# EAGLE design Cargador_RasPi3HAT_CamSlot_v2.1 (EAGLE 9.3.2)
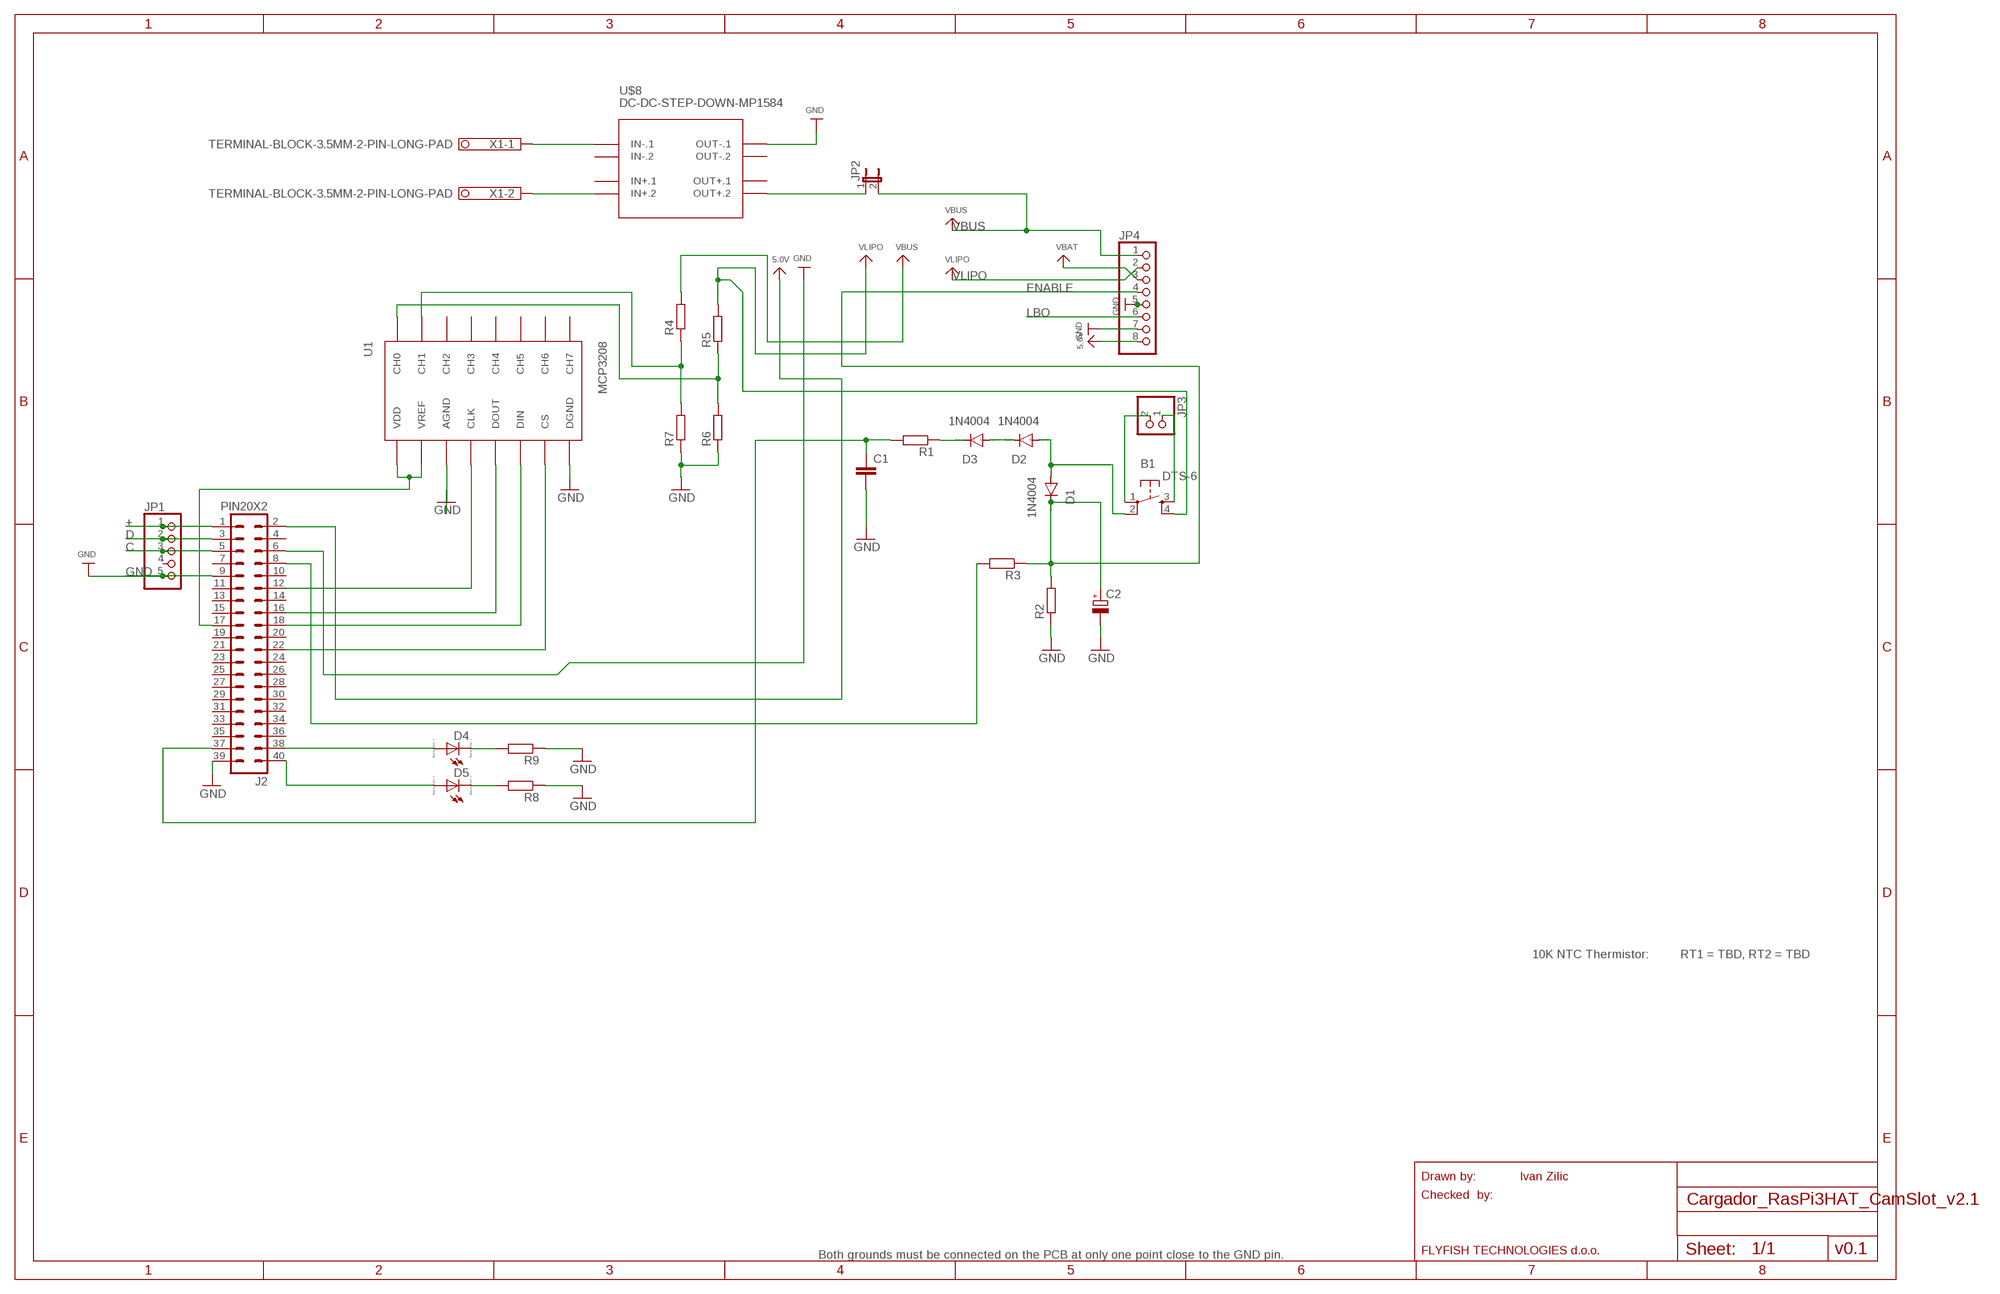
[diagram p0: schematic, sheet 1]

## Parts
B1  DTS-6  [DTS-6]
C1  C2.5/2  [C2.5-2]
C2  CPOL-EUE5-4  [E5-4]
D1  1N4004  [DO41-10]
D2  1N4004  [DO41-10]
D3  1N4004  [DO41-10]
D4  LED_ELD260  [LED_LD260]
D5  LED_ELD260  [LED_LD260]
J2  PIN20X2  [PIN_20X2]
JP1  PINHD-1X5  [1X05]
JP2  JP1E  [JP1]
JP3  PINHD-1X2  [1X02]
JP4  HEADER-1X8  [1X08_OVAL]
R1  R-EU_0207/10  [0207/10]
R2  R-EU_0207/10  [0207/10]
R3  R-EU_0207/10  [0207/10]
R4  R-EU_0207/10  [0207/10]
R5  R-EU_0207/10  [0207/10]
R6  R-EU_0207/10  [0207/10]
R7  R-EU_0207/10  [0207/10]
R8  R-EU_0207/10  [0207/10]
R9  R-EU_0207/10  [0207/10]
U1  MCP3208  [DIL16]
U$8  DC-DC-STEP-DOWN-MP1584  [DC-DC-STEP-DOWN-MP1584]
X1  TERMINAL-BLOCK-3.5MM-2-PIN-LONG-PAD  [TERMINAL-BLOCK-2-PIN-3.5MM-LONG-PAD]

## Nets
5.0V: J2.2 JP4.8
+: J2.1 JP1.1
C: J2.5 JP1.3
D: J2.3 JP1.2
ENABLE: C2.+ D1.C JP4.4 R2.2 R3.1
GND [GND]: C1.2 C2.- J2.6 J2.9 J2.39 JP1.5 JP4.5 JP4.7 R2.1 R6.1 R7.1 R8.1 R9.1 U1.AGND U1.DGND U$8.OUT-.1
LBO: JP4.6
N$1: B1.1 JP3.2
N$2: B1.3 JP3.1
N$3: D4.K(C) R9.2
N$4: D5.K(C) R8.2
N$5: D3.C R1.1
N$6: D5.A J2.40
N$7: D4.A J2.38
N$8: U$8.IN-.1 X1.1
N$9: U$8.IN+.2 X1.2
N$10: JP2.1 U$8.OUT+.2
N$12: J2.17 U1.VDD U1.VREF
N$13 [GND]: R4.1 R7.2 U1.CH1
N$14: R5.1 R6.2 U1.CH0
N$17: J2.8 R3.2
N$18: J2.12 U1.CLK
N$22: J2.22 U1.CS
N$23: D2.C D3.A
N$24 [GND]: B1.2 D1.A D2.A
N$25: J2.18 U1.DIN
N$26: J2.16 U1.DOUT
N$27: C1.1 J2.37 R1.2
VBAT: JP4.3
VBUS: JP2.2 JP4.1 R4.2
VLIPO: B1.4 JP4.2 R5.2
Unconnected: J2.4 J2.7 J2.10 J2.11 J2.13 J2.14 J2.15 J2.19 J2.20 J2.21 J2.23 J2.24 J2.25 J2.26 J2.27 J2.28 J2.29 J2.30 J2.31 J2.32 J2.33 J2.34 J2.35 J2.36 JP1.4 U1.CH2 U1.CH3 U1.CH4 U1.CH5 U1.CH6 U1.CH7 U$8.IN+.1 U$8.IN-.2 U$8.OUT+.1 U$8.OUT-.2

## Notes on the sheet
- 10K NTC Thermistor: | RT1 = TBD, RT2 = TBD
- Drawn by: | Ivan Zilic
- Checked  by:
- Both grounds must be connected on the PCB at only one point close to the GND pin. | FLYFISH TECHNOLOGIES d.o.o. | v0.1

## Library data of the parts
B1 = switch-tact:DTS-6
C1 = capacitor-wima:C: CAPACITOR naming: grid - package width
C2 = rcl:CPOL-EU: POLARIZED CAPACITOR, European symbol; SPICEPREFIX: C
D1-D3 = diode:1N4004: DIODE general purpose rectifier, 1 A
D4 D5 = eagle-ltspice:LED_E: LED Source: http://www.osram.convergy.de Source: www.luxeon.com Source: www.kingbright.com; SPICEMODEL: NONE; SPICEPREFIX: D; SPICETYPE: diode
J2 = FLYFISH:PIN20X2
JP1 = pinhead:PINHD-1X5: PIN HEADER
JP2 = jumper:JP1E: JUMPER
JP3 = pinhead:PINHD-1X2: PIN HEADER
JP4 = microbuilder:HEADER-1X8: PIN HEADER
R1-R9 = rcl:R-EU_: RESISTOR, European symbol; SPICEPREFIX: R
U1 = mcp3208:MCP3208
U$8 = diy-modules:DC-DC-STEP-DOWN-MP1584: DC/DC Step-Down Regulator based on MP1584 chip MP1584 datasheet available here: http://www.haoyuelectronics.com/Attachment/MP1584/MP1584.pdf Click here to find device on ebay.com <http://www.ebay.com/sch/mp1584+module>
X1 = Rembrandt Electronics - Terminal Block 3-5mm v1-0:TERMINAL-BLOCK-3.5MM-2-PIN: Terminal Block 3.5mm Pitch: 3,5 mm Number of pins: 2 Created by Rembrandt Electronics www.rembrandtelectronics.com

## Net classes
1 GND: width 0.254 mm, clearance 0.381 mm

## Board
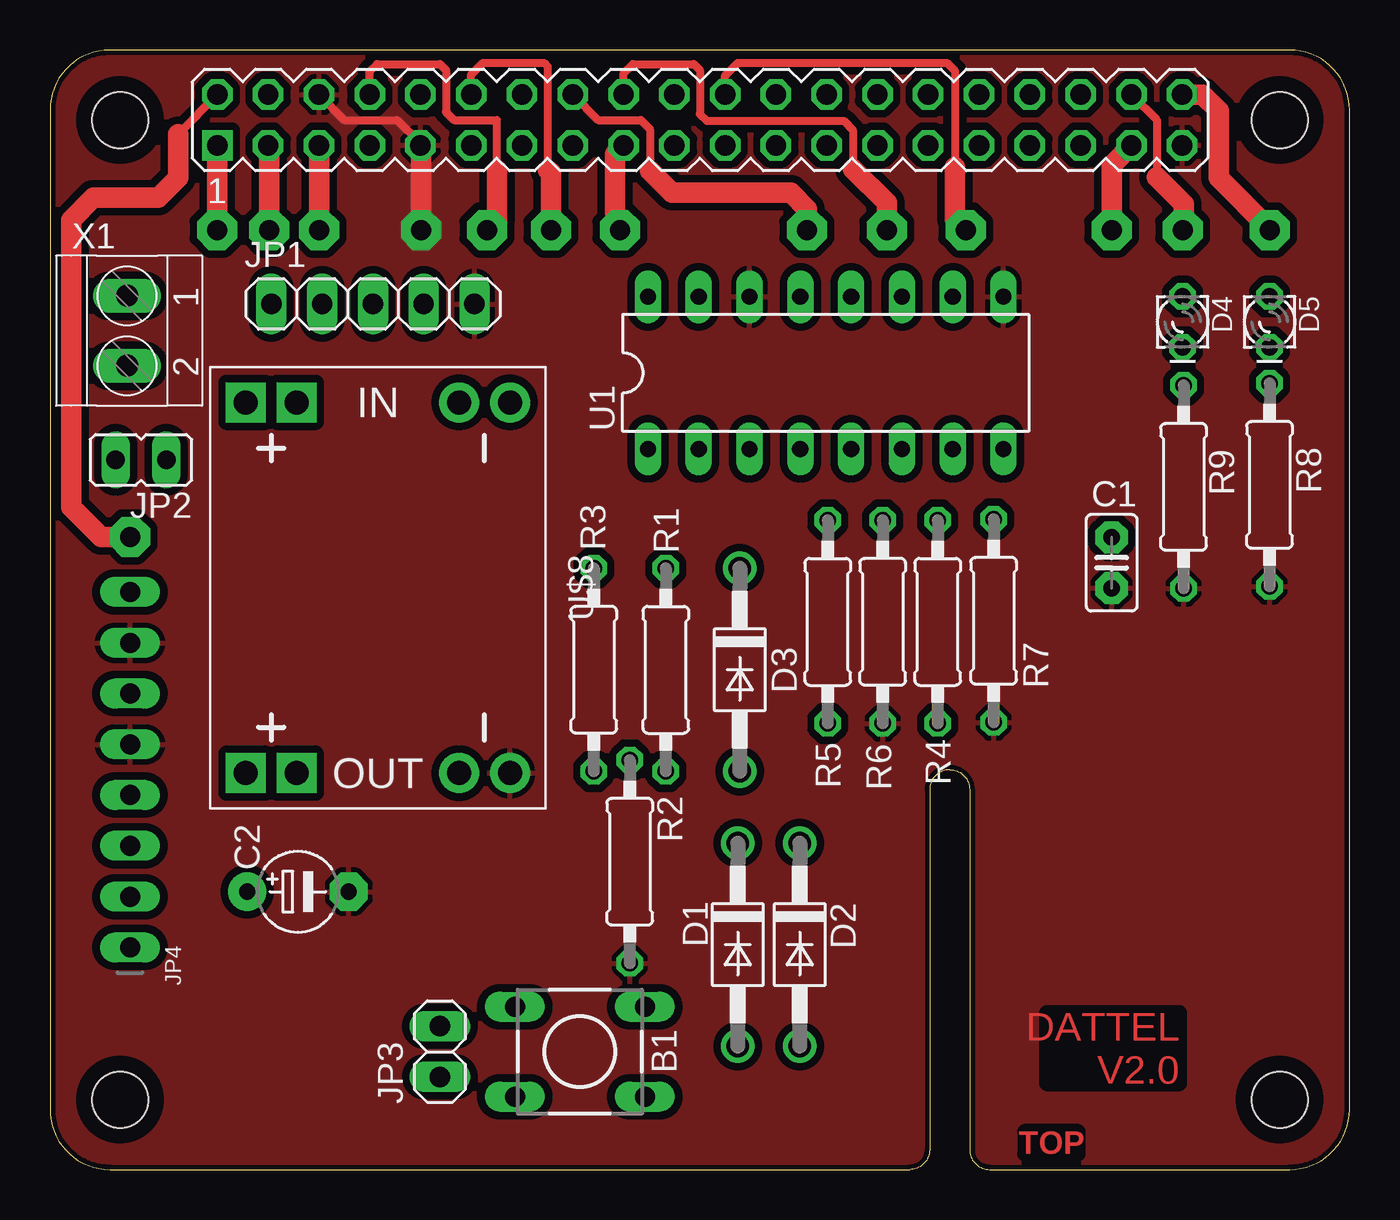
[diagram p1: board, top side]
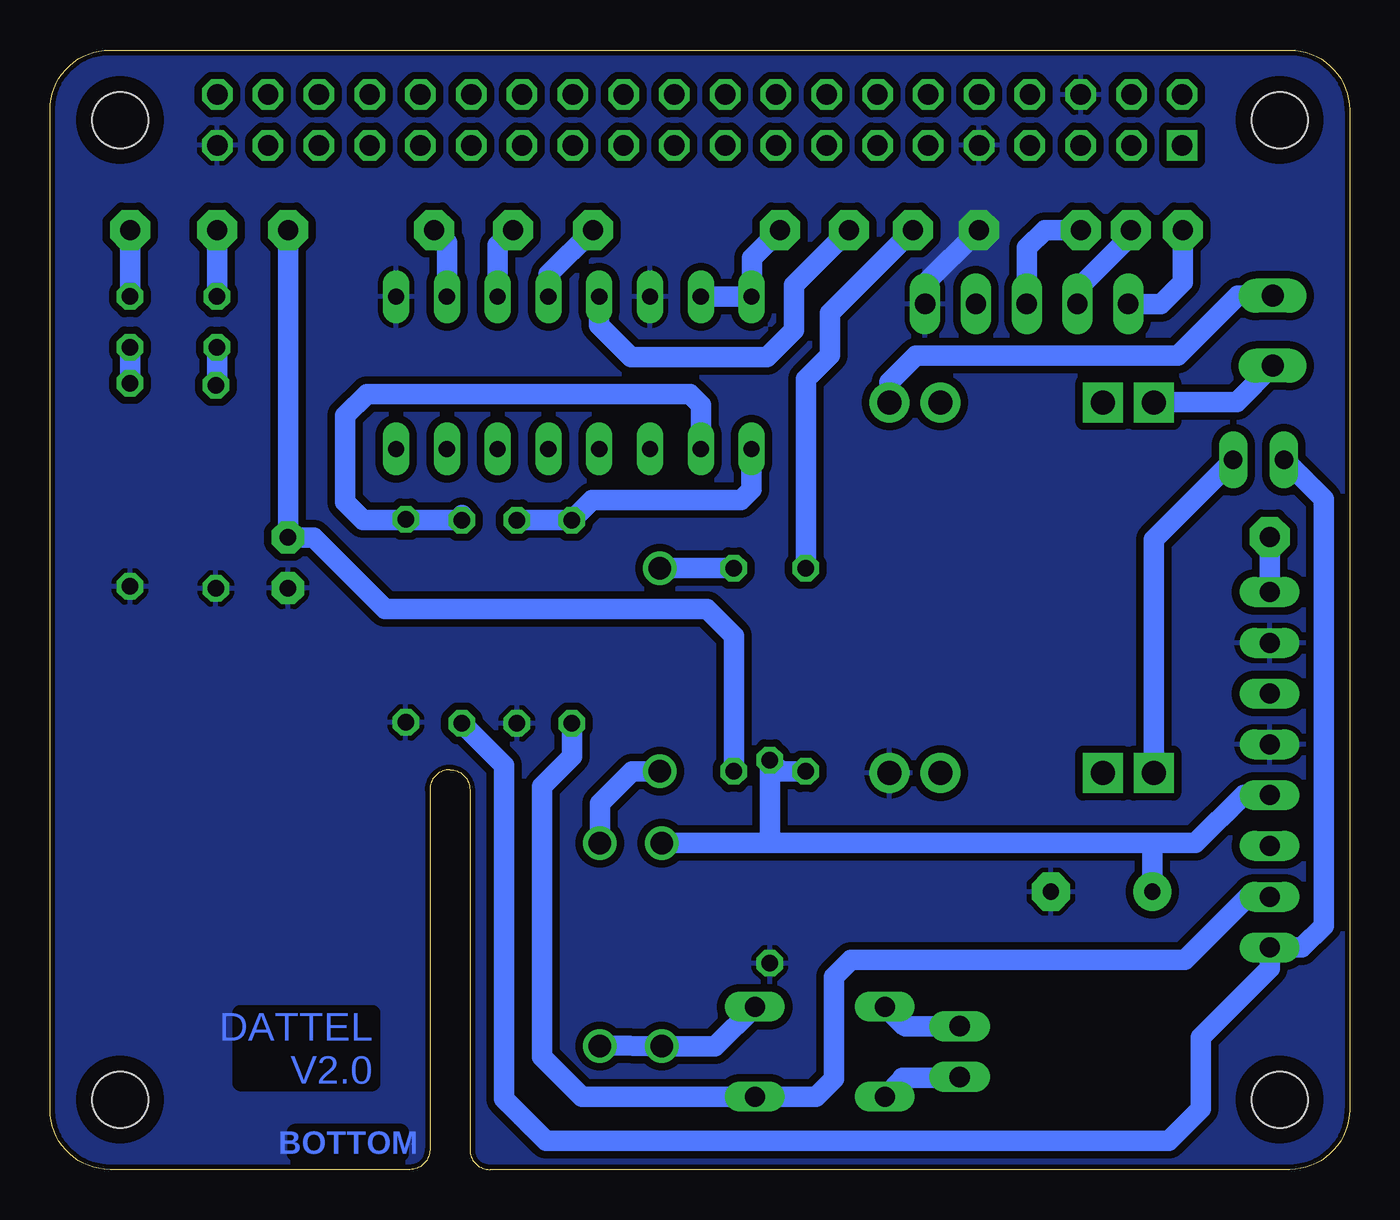
[diagram p2: board, bottom side, seen from below]

Size 65 x 56 mm. Coordinates in mm from the lower left corner, seen from the top.
Outline: 0,3 arc90 3,0 43,0 arc90 44,1 44,19 arc-90 45,20 arc-90 46,19 46,1 arc90 47,0 62,0 arc90 65,3 65,53 arc90 62,56 3,56 arc90 0,53 0,3
Copper layers (1*16): Top 0.035mm / dielectric 1.5mm / Bottom 0.035mm
Design rules "ITEADstudio_DRC": minimum track width 6mil, minimum drill 12mil, track to track 6mil, track to pad 6mil, pad to pad 6mil, via to via 6mil, smd to smd 0mil, copper to edge 10mil, drill to drill 10mil, minimum pad ring 10mil, minimum via ring 6mil, stop-mask expansion 2mil, vias tented up to drill 100mil, thermal gap 10mil
Holes 2.8 mm at 3.5,3.5 3.5,52.5 61.5,52.5 61.5,3.5
tRestrict: area 1.9,51 to 5,54; area 60,51 to 63,54; area 60,1.9 to 63,5; area 1.9,1.9 to 5,5
bRestrict: area 1.9,1.9 to 5,5; area 1.9,51 to 5,54; area 60,1.9 to 63,5; area 60,51 to 63,54

### Footprints (pad centres in the part's own frame; a part is rotated, then mirrored left to right if it is on the bottom)
DTS-6 = drill 1 long: 1 -3.25,2.25; 2 3.25,2.25; 3 -3.25,-2.25; 4 3.25,-2.25
C2.5-2 = drill 0.813 pad 1.6 octagon: 1 -1.27,0; 2 1.27,0
E5-4 = drill 0.813 pad 1.905: + -2.54,0 | drill 0.813 pad 1.905 octagon: - 2.54,0
DO41-10 = drill 1.118: A 5.08,0; C -5.08,0
LED_LD260 = drill 0.813 octagon: A -1.27,0; K 1.27,0
PIN_20X2 = drill 1.016 square: 1 -24.13,-1.27 | drill 1.016 octagon: 2 -24.13,1.27; 3 -21.59,-1.27; 4 -21.59,1.27; 5 -19.05,-1.27; 6 -19.05,1.27; 7 -16.51,-1.27; 8 -16.51,1.27; 9 -13.97,-1.27; 10 -13.97,1.27; 11 -11.43,-1.27; 12 -11.43,1.27; 13 -8.89,-1.27; 14 -8.89,1.27; 15 -6.35,-1.27; 16 -6.35,1.27; 17 -3.81,-1.27; 18 -3.81,1.27; 19 -1.27,-1.27; 20 -1.27,1.27; 21 1.27,-1.27; 22 1.27,1.27; 23 3.81,-1.27; 24 3.81,1.27; 25 6.35,-1.27; 26 6.35,1.27; 27 8.89,-1.27; 28 8.89,1.27; 29 11.43,-1.27; 30 11.43,1.27; 31 13.97,-1.27; 32 13.97,1.27; 33 16.51,-1.27; 34 16.51,1.27; 35 19.05,-1.27; 36 19.05,1.27; 37 21.59,-1.27; 38 21.59,1.27; 39 24.13,-1.27; 40 24.13,1.27
1X05 = drill 1.016 long: 1 -5.08,0; 2 -2.54,0; 3 0,0; 4 2.54,0; 5 5.08,0
JP1 = drill 0.914 long: 1 0,-1.27; 2 0,1.27
1X02 = drill 1.016 long: 1 -1.27,0; 2 1.27,0
1X08_OVAL = drill 1 long: 1 -8.89,0; 2 -6.35,0; 3 -3.81,0; 4 -1.27,0; 5 1.27,0; 6 3.81,0; 7 6.35,0; 8 8.89,0
0207/10 = drill 0.813 octagon: 1 -5.08,0; 2 5.08,0
DIL16 = drill 0.813 long: AGND -3.81,3.81; CH0 -8.89,-3.81; CH1 -6.35,-3.81; CH2 -3.81,-3.81; CH3 -1.27,-3.81; CH4 1.27,-3.81; CH5 3.81,-3.81; CH6 6.35,-3.81; CH7 8.89,-3.81; CLK -1.27,3.81; CS 6.35,3.81; DGND 8.89,3.81; DIN 3.81,3.81; DOUT 1.27,3.81; VDD -8.89,3.81; VREF -6.35,3.81
DC-DC-STEP-DOWN-MP1584 = drill 1.2 pad 2 square: IN+.1 -9.271,-4.064; IN+.2 -9.271,-6.604; OUT+.1 9.271,-4.064; OUT+.2 9.271,-6.604 | drill 1.2 pad 2: IN-.1 -9.271,6.604; IN-.2 -9.271,4.064; OUT-.1 9.271,6.604; OUT-.2 9.271,4.064
TERMINAL-BLOCK-2-PIN-3.5MM-LONG-PAD = drill 1.1 pad 1.7 long: 1 -1.75,-0.1; 2 1.75,-0.1

### Placement (x,y rotation side)
B1  26.5,5.9 0 top
C1  53.1,30.35 270 top
C2  12.4,13.9 0 top
D1  34.4,11.25 270 top
D2  37.5,11.25 270 top
D3  34.5,25 270 top
D4  56.65,42.4 270 top
D5  61,42.4 270 top
J2  32.5,52.5 0 top
JP1  16.15,43.3 0 top
JP2  4.55,35.5 90 top
JP3  19.5,5.9 90 top
JP4  4,20 90 top
R1  30.8,25 270 top
R2  29,15.4 90 top
R3  27.2,25 90 top
R4  44.4,27.4 270 top
R5  38.9,27.4 270 top
R6  41.65,27.4 90 top
R7  47.2,27.45 90 top
R8  61,34.25 90 top
R9  56.7,34.15 90 top
U1  38.8,39.85 0 top
U$8  16.4,29.1 270 top
X1  3.95,41.95 270 top

### Tracks (layer width: path | path; a pad name or v marks a point on that pad's centre or on a via)
5.0V  (via drill 1 pad 2)
  Top 0.406: J2.2 6.4,51.8
  Top 1.016: 6.4,51.8 6.4,49.6 5.4,48.6 2.15,48.6 1.05,47.5 1.05,33.15 2.55,31.65 v4,31.65
  Bottom 1.016: v4,31.65 JP4.8
+  (via drill 1 pad 2)
  Top 0.152: 8.37,46.87 v8.35,47
  Top 1.016: J2.1 8.37,46.87
  Bottom 1.016: v8.35,47 8.35,44.4 9.45,43.3 JP1.1
C  (via drill 1 pad 2)
  Top 1.016: J2.5 v13.45,47
  Bottom 1.016: v13.45,47 15.25,47 16.15,46.1 JP1.3
D  (via drill 1 pad 2)
  Top 0.152: 10.95,51.19 J2.3
  Top 1.016: v10.95,47 10.95,51.19
  Bottom 1.016: v10.95,47 10.95,46.7 13.61,44.04 JP1.2
ENABLE
  Bottom 0.254: 4.02,18.75 JP4.4 | 9.86,16.32 9.85,16.33
  Bottom 1.016: R3.1 28.44,19.92 R2.2 29,16.33 | 29,16.33 12.29,16.33 9.85,16.33 7.72,16.33 5.3,18.75 4.02,18.75 | 29,16.33 D1.C | C2.+ 9.86,16.32
GND  (via drill 1 pad 2)
  Top 0.254: 18.55,51.21 J2.9 18.5,51.2 18.5,51.35
  Top 0.406: J2.6 14.72,52.5 17.35,52.5 18.5,51.35
  Top 1.016: 18.55,51.21 v18.55,47
  Bottom 1.016: v18.55,47 21.23,44.32 JP1.5
  pour Bottom: 0,3 arc90 3,0 43,0 arc90 44,1 44,19 arc-90 45,20 arc-90 46,19 46,1 arc90 47,0 62,0 arc90 65,3 65,53 arc90 62,56 3,56 arc90 0,53
  pour Top: 0,3 arc90 3,0 43,0 arc90 44,1 44,19 arc-90 45,20 arc-90 46,19 46,1 arc90 47,0 62,0 arc90 65,3 65,53 arc90 62,56 3,56 arc90 0,53
  pour Bottom: -0.55,56.8 63.95,56.8 66.15,54.6 66.15,1.15 64.35,-0.65 1.2,-0.65 -1,1.55 -1,56.35
N$1
  Bottom 1.016: JP3.2 22.22,7.17 22.34,7.24 B1.1
N$2
  Bottom 1.016: JP3.1 19.55,4.58 22.37,4.58 22.35,4.55 B1.3
N$3
  Bottom 0.152: 56.65,39.28 R9.2
  Bottom 1.016: D4.K 56.65,39.28
N$4
  Bottom 1.016: D5.K R8.2
N$5
  Bottom 1.016: D3.C R1.1
N$6  (via drill 1 pad 2)
  Top 0.152: 61,47.05 v61,47
  Top 1.016: J2.40 57.63,53.77 58.45,52.95 58.45,49.6 61,47.05
  Bottom 1.016: D5.A v61,47
N$7  (via drill 1 pad 2)
  Top 0.152: v56.65,47 56.7,47.05
  Top 0.406: J2.38 55.35,52.51 55.35,49.65
  Top 1.016: 55.35,49.65 56.7,48.3 56.7,47.05
  Bottom 1.016: D4.A v56.65,47
N$8
  Bottom 1.016: X1.1 5.6,43.7 8.6,40.7 21.7,40.7 23,39.4 U$8.IN-.1
N$9
  Bottom 1.016: U$8.IN+.2 9.77,38.4 5.65,38.4 X1.2
N$10
  Bottom 1.016: JP2.1 9.8,31.52 U$8.OUT+.2
N$12  (via drill 1 pad 2)
  Top 1.016: J2.17 28.25,50.79 28.25,47.85 v28.5,47
  Bottom 1.016: U1.VREF U1.VDD 29.9,45.6 v28.5,47
N$13
  Bottom 1.016: 47.15,32.48 R7.2 | 47.15,32.48 49.33,32.48 50.25,33.4 50.25,37.7 49.15,38.8 33,38.8 32.45,38.25 U1.CH1 | 47.15,32.48 R4.1 44.4,32.75
N$14
  Bottom 1.016: R6.2 R5.1 37.9,33.48 30.45,33.48 29.91,34.02 U1.CH0
N$17  (via drill 1 pad 2)
  Top 0.406: J2.8 15.99,54.94 16.35,55.3 19.5,55.3 19.8,55 19.8,52.9 20.2,52.5 22.35,52.5 22.35,50
  Top 1.016: 22.35,50 22.35,47.5 v21.85,47
  Bottom 1.016: v21.85,47 26,42.85 26,40.73 27.2,39.53 R3.2
N$18  (via drill 1 pad 2)
  Top 0.406: J2.12 21.07,54.77 21.65,55.35 24.7,55.35 24.9,55.15 24.9,50
  Top 1.016: 24.9,50 25.05,49.85 v25.05,47
  Bottom 1.016: U1.CLK 37.53,42.23 35.95,40.65 29.15,40.65 27.8,42 27.8,44.25 v25.05,47
N$22  (via drill 1 pad 2)
  Top 0.406: J2.22 33.77,54.72 34.4,55.35 44.85,55.35 45.25,54.95 45.25,50.15
  Top 1.016: 45.25,50.15 45.25,47.55 v45.8,47
  Bottom 1.016: U1.CS 45.15,46.35 v45.8,47
N$23
  Bottom 1.016: D2.C 37.5,18.31 35.89,19.92 D3.A
N$24
  Bottom 1.016: D2.A 37.45,6.22 D1.A 31.73,6.17 B1.2
N$25  (via drill 1 pad 2)
  Top 0.406: J2.18 28.69,54.84 29.15,55.3 32.2,55.3 32.5,55 32.5,52.8 32.85,52.45 39.7,52.45 40.15,52 40.15,50.05
  Top 1.016: 40.15,50.05 41.85,48.35 v41.85,47
  Bottom 0.254: 42.61,46.24 v41.85,47
  Bottom 1.016: U1.DIN 42.61,46.24
N$26  (via drill 1 pad 2)
  Top 0.406: J2.16 27.42,52.5 29.55,52.5 30,52.05 30,49.95
  Top 1.016: 30,49.95 31.1,48.85 37.05,48.85 37.85,48.05 v37.85,47
  Bottom 1.016: v37.85,47 40.07,44.78 U1.DOUT
N$27  (via drill 1 pad 2)
  Top 1.016: v53.1,47 53.1,50.24 J2.37
  Bottom 1.016: R1.2 30.8,26.7 32.15,28.05 48.25,28.05 51.82,31.62 C1.1 v53.1,47
VBUS
  Bottom 1.016: R4.2 42.3,20.22 42.3,3.55 40.2,1.45 9.05,1.45 7.45,3.05 7.45,6.61 4,10.06 JP4.1 2.39,11.11 1.3,12.2 1.3,33.55 3.25,35.5 JP2.2
VLIPO
  Bottom 1.016: R5.2 38.9,20.67 40.4,19.17 40.4,5.65 38.4,3.65 B1.4 26.7,3.65 25.8,4.55 25.8,9.65 24.95,10.5 8.25,10.5 5.1,13.65 JP4.2

### Text on the board
Top: DATTEL / V2.0 | TOP
Bottom: DATTEL / V2.0 | BOTTOM